# EAGLE design 2 Motors_V4 (EAGLE 9.6.2)
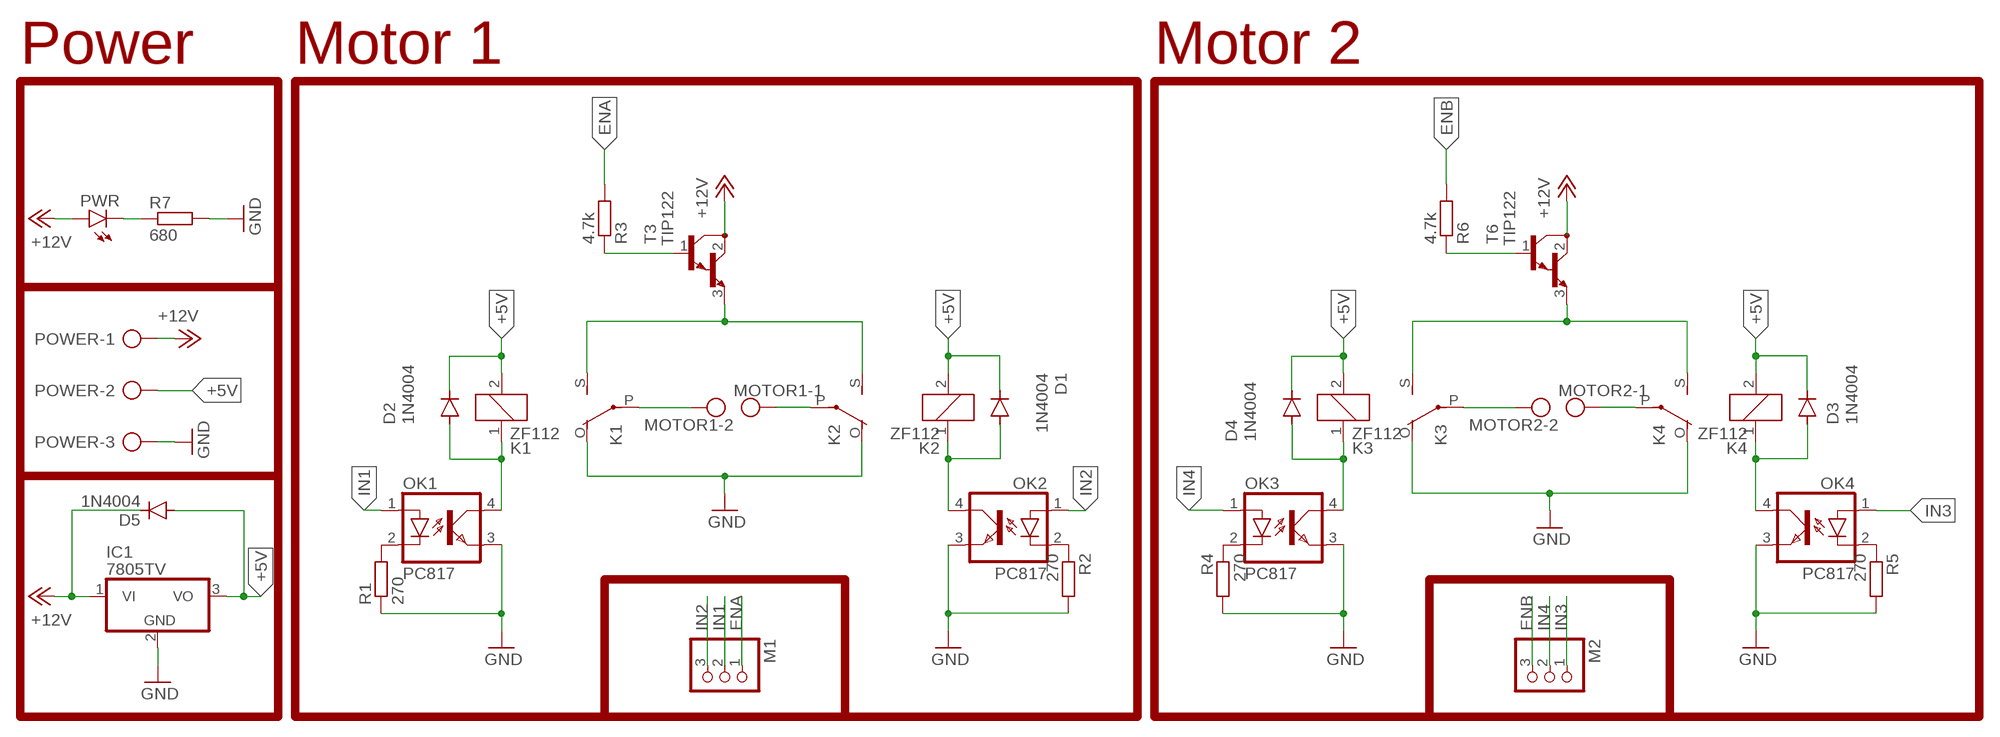
[diagram p0: schematic, sheet 1]

## Parts
D1  1N4004  [DO41-10]
D2  1N4004  [DO41-10]
D3  1N4004  [DO41-10]
D4  1N4004  [DO41-10]
D5  1N4004  [DO41-10]
IC1  7805TV  [TO220V]
K1  ZF112  [ZF112]
K2  ZF112  [ZF112]
K3  ZF112  [ZF112]
K4  ZF112  [ZF112]
M1  PINHD-1X3  [1X03]
M2  PINHD-1X3  [1X03]
MOTOR1  AK300/2  [AK300/2]
MOTOR2  AK300/2  [AK300/2]
OK1  PC817  [DIL04]
OK2  PC817  [DIL04]
OK3  PC817  [DIL04]
OK4  PC817  [DIL04]
POWER  AK300/3  [AK300/3]
PWR  LED5MM  [LED5MM]
R1  270  R-EU_0204/7  [0204/7]
R2  270  R-EU_0204/7  [0204/7]
R3  4.7k  R-EU_0204/7  [0204/7]
R4  270  R-EU_0204/7  [0204/7]
R5  270  R-EU_0204/7  [0204/7]
R6  4.7k  R-EU_0204/7  [0204/7]
R7  680  R-EU_0204/7  [0204/7]
T3  TIP122  [TO220]
T6  TIP122  [TO220]

## Nets
+5V: D1.C D2.C D3.C D4.C D5.A IC1.3(VO) K1.2 K2.2 K3.2 K4.2 POWER.2
+12V: D5.C IC1.1(VI) POWER.1 PWR.A T3.2(C) T6.2(C)
ENA: M1.1 R3.2
ENB: M2.3 R6.2
GND: IC1.2(GND) K1.O(2:O) K2.O(2:O) K3.O(2:O) K4.O(2:O) OK1.3(EMIT) OK2.3(EMIT) OK3.3(EMIT) OK4.3(EMIT) POWER.3 R1.1 R2.2 R4.2 R5.2 R7.2
IN1: M1.2 OK1.1(A)
IN2: M1.3 OK2.1(A)
IN3: M2.1 OK4.1(A)
IN4: M2.2 OK3.1(A)
N$1: K1.P(2:P) MOTOR1.2
N$2: K1.S(2:S) K2.S(2:S) T3.3(E)
N$3: D2.A K1.1 OK1.4(COL)
N$4: PWR.K(C) R7.1
N$5: K2.P(2:P) MOTOR1.1
N$6: D1.A K2.1 OK2.4(COL)
N$7: D3.A K4.1 OK4.4(COL)
N$8: K3.S(2:S) K4.S(2:S) T6.3(E)
N$9: D4.A K3.1 OK3.4(COL)
N$10: OK1.2(C) R1.2
N$11: OK2.2(C) R2.1
N$12: OK4.2(C) R5.1
N$13: OK3.2(C) R4.1
N$14: K4.P(2:P) MOTOR2.1
N$16: K3.P(2:P) MOTOR2.2
T3: R3.1 T3.1(B)
T6: R6.1 T6.1(B)

## Notes on the sheet
- Power | Motor 1 | Motor 2

## Library data of the parts
D1-D5 = diode:1N4004: DIODE general purpose rectifier, 1 A
IC1 = linear:78*: Positive VOLTAGE REGULATOR Source: http://cache.national.com/ds/LM/LM78L05.pdf http://www.fairchildsemi.com/ds/LM/LM7805.pdf
K1-K4 = relay:ZF112: RELAY 1 x switch; OC_FARNELL: unknown; OC_NEWARK: unknown
M1 M2 = pinhead:PINHD-1X3: PIN HEADER
MOTOR1 MOTOR2 = con-ptr500:AK300/2: CONNECTOR; OC_FARNELL: unknown; OC_NEWARK: unknown
OK1-OK4 = optocoupler:PC817: SHARP OPTO COUPLER; MPN: PC817X4J000F; OC_FARNELL: 9707727; OC_NEWARK: 97K7059
POWER = con-ptr500:AK300/3: CONNECTOR; OC_FARNELL: unknown; OC_NEWARK: unknown
PWR = led:LED: LED OSRAM: - CHIPLED LG R971, LG N971, LY N971, LG Q971, LY Q971, LO R971, LY R971 LH N974, LH R974 LS Q976, LO Q976, LY Q976 LO Q996 - Hyper CHIPLED LW Q18S LB Q993, LB Q99A, LB R99A - SideLED LS A670, LO A670, LY A670, LG A670, LP A670 LB A673, LV A673, LT A673, LW A673 LH A674 LY A675 LS A676, LA A676, LO A676, LY A676, LW A676 LS A679, LY A679, LG A679 - Hyper Micro SIDELED® LS Y876, LA Y876, LO Y876, LY Y876 LT Y87S - SmartLED LW L88C, LW L88S LB L89C, LB L89S, LG L890 LS L89K, LO L89K, LY L89K LS L896, LA L896, LO L896, LY L896 - TOPLED LS T670, LO T670, LY T670, LG T670, LP T670 LSG T670, LSP T670, LSY T670, LOP T670, LYG T670 LG T671, LOG T671, LSG T671 LB T673, LV T673, LT T673, LW T673 LH T674 LS T676, LA T676, LO T676, LY T676, LB T676, LH T676, LSB T676, LW T676 LB T67C, LV T67C, LT T67C, LS T67K, LO T67K, LY T67K, LW E67C LS E67B, LA E67B, LO E67B, LY E67B, LB E67C, LV E67C, LT E67C LW T67C LS T679, LY T679, LG T679 LS T770, LO T770, LY T770, LG T770, LP T770 LB T773, LV T773, LT T773, LW T773 LH T774 LS E675, LA E675, LY E675, LS T675 LS T776, LA T776, LO T776, LY T776, LB T776 LHGB T686 LT T68C, LB T68C - Hyper Mini TOPLED® LB M676 - Mini TOPLED Santana® LG M470 LS M47K, LO M47K, LY M47K Source: http://www.osram.convergy.de LUXEON: - LUMILED® LXK2-PW12-R00, LXK2-PW12-S00, LXK2-PW14-U00, LXK2-PW14-V00 LXK2-PM12-R00, LXK2-PM12-S00, LXK2-PM14-U00 LXK2-PE12-Q00, LXK2-PE12-R00, LXK2-PE12-S00, LXK2-PE14-T00, LXK2-PE14-U00 LXK2-PB12-K00, LXK2-PB12-L00, LXK2-PB12-M00, LXK2-PB14-N00, LXK2-PB14-P00, LXK2-PB14-Q00 LXK2-PR12-L00, LXK2-PR12-M00, LXK2-PR14-Q00, LXK2-PR14-R00 LXK2-PD12-Q00, LXK2-PD12-R00, LXK2-PD12-S00 LXK2-PH12-R00, LXK2-PH12-S00 LXK2-PL12-P00, LXK2-PL12-Q00, LXK2-PL12-R00 Source: www.luxeon.com KINGBRIGHT: KA-3528ASYC Source: www.kingbright.com
R1-R7 = rcl:R-EU_: RESISTOR, European symbol; SPICEPREFIX: R
T3 T6 = transistor:TIP122: NPN BIPOLAR DARLINGTON TRANSISTOR

## Board
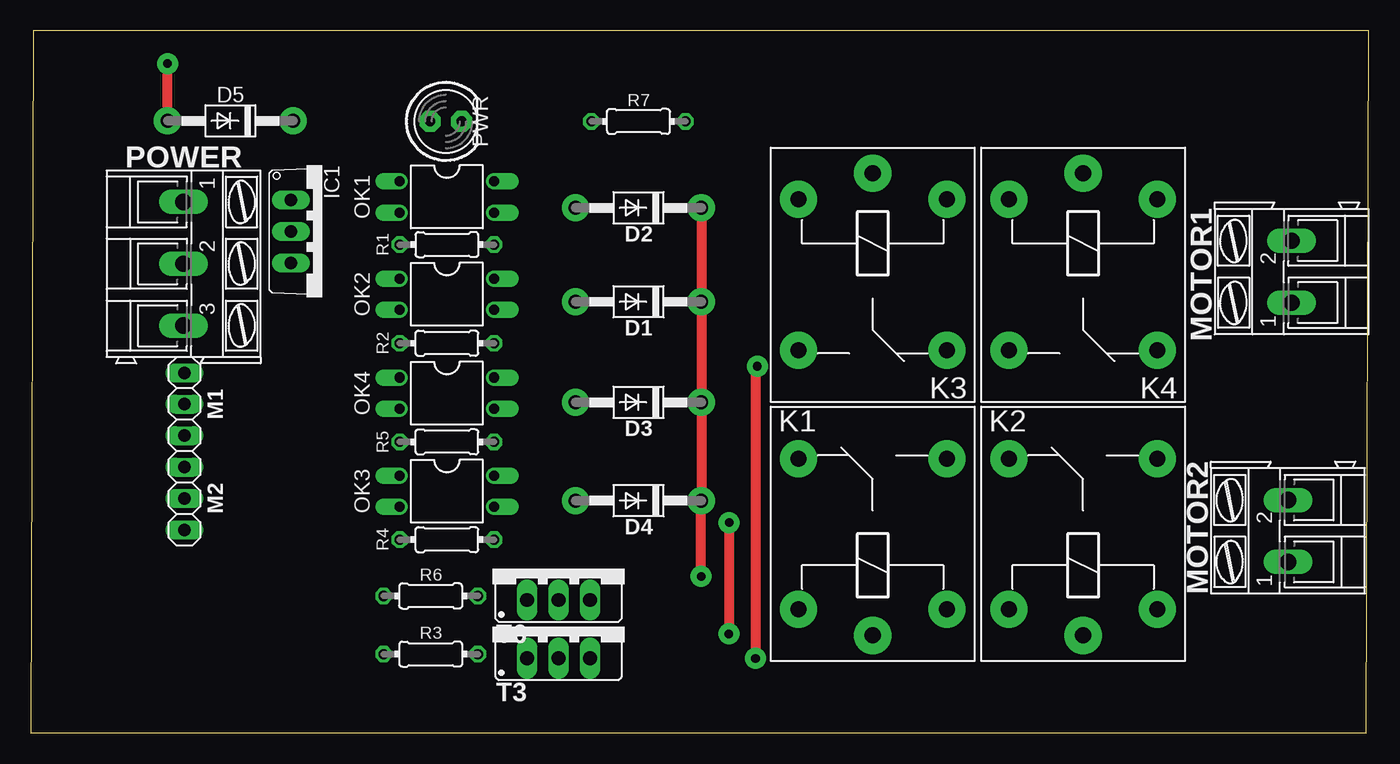
[diagram p1: board, top side]
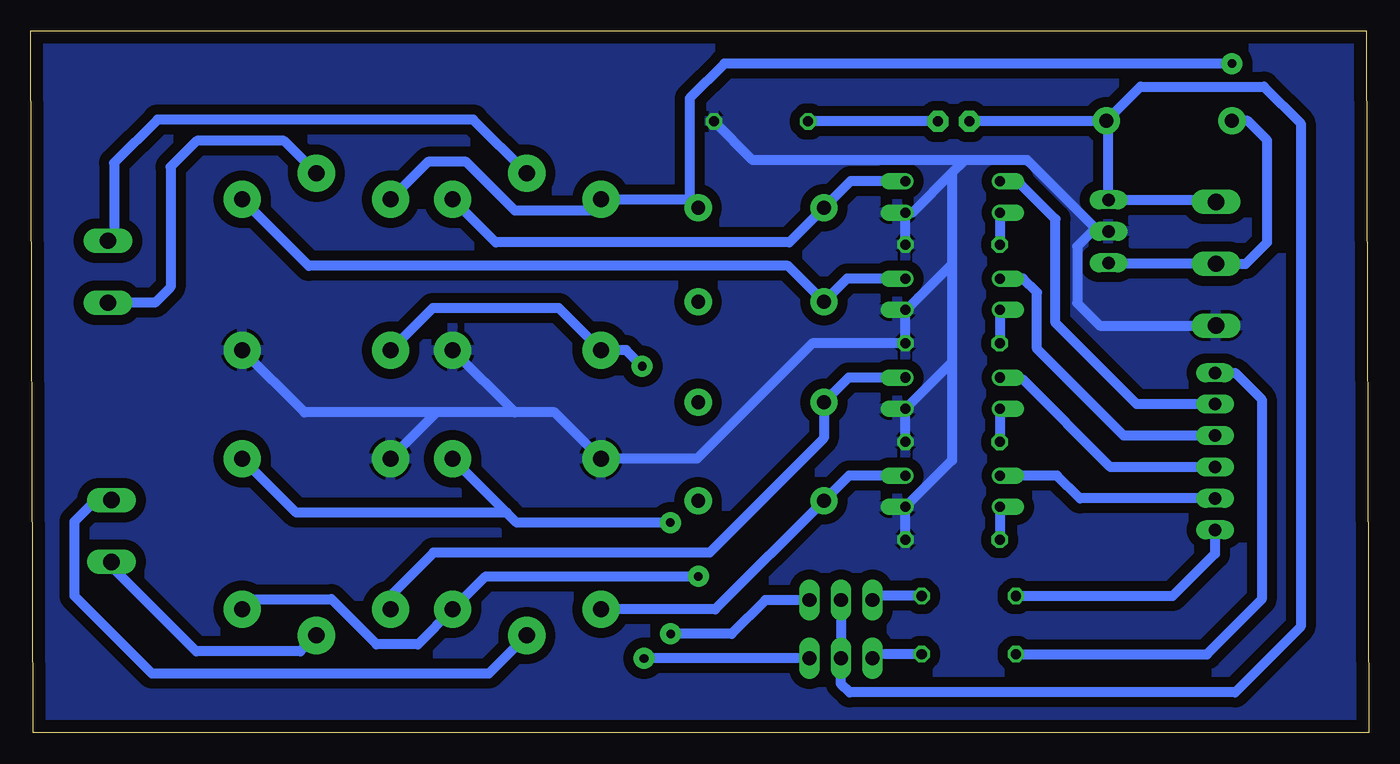
[diagram p2: board, bottom side, seen from below]

Size 108.18 x 56.74 mm. Coordinates in mm from the lower left corner, seen from the top.
Outline: 108,0 108.18,56.74 0.18,56.74 0,0 108,0
Copper layers (1*16): Top 0.035mm / dielectric 1.5mm / Bottom 0.035mm
Design rules "default *": minimum track width 0.8mm, minimum drill 0.35mm, track to track 0.6mm, track to pad 0.6mm, pad to pad 0.6mm, via to via 0.6mm, smd to smd 0.6mm, copper to edge 40mil, drill to drill 6mil, minimum pad ring 10mil, minimum via ring 8mil, stop-mask expansion 4mil, vias tented up to drill 0mil, thermal gap 10mil

### Footprints (pad centres in the part's own frame; a part is rotated, then mirrored left to right if it is on the bottom)
DO41-10 = drill 1.118 pad 2.2: A 5.08,0; C -5.08,0
TO220V = drill 1.016 long: 1 -2.54,-2.54; 2 0,-2.54; 3 2.54,-2.54
ZF112 = drill 1.3 pad 3: 1 -6.096,5.994; 2 -6.096,-5.994; O 6.096,5.994; P -8.204,0; S 6.096,-5.994
1X03 = drill 1.016 long: 1 -2.54,0; 2 0,0; 3 2.54,0
AK300/2 = drill 1.321 long: 1 -2.515,0; 2 2.489,0
DIL04 = drill 0.813 offset: 1 -1.27,-3.81; 2 1.27,-3.81; 3 1.27,3.81; 4 -1.27,3.81
AK300/3 = drill 1.321 long: 1 -5.004,0; 2 0,0; 3 5.004,0
LED5MM = drill 0.813 pad 1.7 octagon: A -1.27,0; K 1.27,0
0204/7 = drill 0.813 octagon: 1 -3.81,0; 2 3.81,0
TO220 = drill 1.118 long: 1 -2.54,0; 2 0,0; 3 2.54,0

### Placement (x,y rotation side)
D1  49.13,34.85 180 top
D2  49.13,42.44 180 top
D3  49.13,26.72 180 top
D4  49.13,18.77 180 top
D5  16.13,49.48 180 top
IC1  23.57,40.54 270 top
K1  68.07,37.03 270 top
K2  85.09,37.03 270 top
K3  68.07,16.08 90 top
K4  85.09,16.08 90 top
M1  12.42,26.57 270 top
M2  12.42,18.95 270 top
MOTOR1  101.96,37.29 90 top
MOTOR2  101.65,16.33 90 top
OK1  33.64,43.33 270 top
OK2  33.64,35.46 270 top
OK3  33.64,19.53 270 top
OK4  33.64,27.46 270 top
POWER  12.34,37.92 270 top
PWR  33.55,49.43 0 top
R1  33.64,39.47 180 top
R2  33.64,31.5 0 top
R3  32.33,6.37 180 top
R4  33.64,15.62 0 top
R5  33.64,23.52 0 top
R6  32.33,11.06 180 top
R7  49.13,49.43 0 top
T3  42.67,6.04 0 top
T6  42.67,10.73 0 top

### Tracks (layer width: path | path; a pad name or v marks a point on that pad's centre or on a via)
+5V  (via drill 0.7 pad 1.7)
  Top 0.813: D2.C D1.C D3.C D4.C v54.2,12.65 | D5.A v11.05,54.1
  Bottom 0.813: IC1.3 20.95,37.92 POWER.2 9.93,37.92 8.2,39.65 8.2,47.9 9.78,49.48 D5.A | v54.2,12.65 71.4,12.65 K3.2 76.89,7.16 80.22,7.16 83.87,10.81 90.25,10.81 K4.2 | K2.2 76.07,46.15 72.97,46.15 69.04,42.22 62.99,42.22 K1.2 54.9,43.13 | 54.9,43.13 D2.C | v11.05,54.1 52.09,54.1 54.9,51.3 54.9,43.13
+12V
  Bottom 0.813: POWER.1 12.5,43.08 IC1.1 21.03,49.3 D5.C | D5.C 21.26,49.43 PWR.A | T6.2 T3.2 42.67,3.99 41.96,3.28 10.79,3.28 5.49,8.59 5.49,49.28 8.46,52.25 18.44,52.25 D5.C
ENA
  Bottom 0.813: M1.1 10.79,29.11 8.64,26.95 8.64,10.79 13.08,6.35 28.51,6.35 R3.2
ENB
  Bottom 0.813: R6.2 15.83,11.06 12.42,14.48 M2.3
GND
  Bottom 0.813: R4.2 OK3.3 33.68,22.04 33.68,29.96 | R5.2 OK4.3 33.68,29.96 | R1.1 OK1.3 36.91,42.06 33.68,45.29 | IC1.2 21.92,40.54 | IC1.2 21.85,40.54 27.61,46.3 32.66,46.3 | 33.68,45.29 32.66,46.3 | 33.68,45.29 33.68,37.9 | 33.68,37.9 37.39,34.19 OK2.3 R2.2 44.98,31.5 54.3,22.17 K3.O 65.81,25.91 69.04,25.91 | 33.68,37.9 33.68,29.96 | IC1.2 22.35,40.54 23.56,39.33 23.56,34.74 21.74,32.92 POWER.3 | 32.66,46.3 49.82,46.3 R7.2 | K2.O 86.06,25.91 75.39,25.91 | 69.04,25.91 75.39,25.91 | 69.04,25.91 K1.O | 75.39,25.91 79.1,22.2 K4.O
  pour Bottom (isolate 0.8): -2.54,58.42 110.49,58.42 110.49,-1.27 -2.54,-1.27
IN1
  Bottom 0.813: M1.2 18.75,26.57 25.32,33.15 25.32,41.53 28.4,44.6 OK1.1
IN2
  Bottom 0.813: M1.3 19.81,24.03 26.82,31.04 26.82,35.61 27.94,36.73 OK2.1
IN3
  Bottom 0.813: M2.1 20.88,21.49 27.96,28.57 29.68,28.57 OK4.1
IN4
  Bottom 0.813: M2.2 23.34,18.95 25.2,20.8 OK3.1
N$1
  Bottom 0.813: K1.P 72.42,49.58 97.94,49.58 101.45,46.08 101.45,40.28 MOTOR1.2
N$2  (via drill 0.7 pad 1.7)
  Top 0.813: v58.75,29.64 58.6,29.49 v58.6,6.02
  Bottom 0.813: T3.3 58.58,6.04 v58.6,6.02 | v58.75,29.64 60.05,30.94 K1.S 65.48,34.34 75.69,34.34 K2.S
N$3
  Bottom 0.813: OK1.4 41.89,44.6 D2.A 46.85,39.65 70.59,39.65 K1.1
N$4
  Bottom 0.813: PWR.K R7.1
N$5
  Bottom 0.813: K2.P 87.71,47.85 94.77,47.85 96.88,45.74 96.88,36.04 98.15,34.77 MOTOR1.1
N$6
  Bottom 0.813: OK2.4 42.17,36.73 D1.A 46.95,37.74 85.7,37.74 K2.1
N$7
  Bottom 0.813: OK4.4 42.05,28.73 D3.A 44.05,23.82 53.3,14.58 75.62,14.58 79.1,11.1 K4.1
N$8  (via drill 0.7 pad 1.7)
  Top 0.813: v56.44,8 56.44,16.97 v56.46,16.99
  Bottom 0.813: T6.3 48.78,10.73 51.51,8 v56.44,8 | v56.46,16.99 68.89,16.99 69.7,17.8 | 69.7,17.8 K3.S | 69.7,17.8 86.72,17.8 K4.S
N$9
  Bottom 0.813: OK3.4 42.02,20.8 D4.A 52.84,9.98 K3.1
N$10
  Bottom 0.813: OK1.2 R1.2
N$11
  Bottom 0.813: OK2.2 R2.1
N$12
  Bottom 0.813: OK4.2 R5.1
N$13
  Bottom 0.813: OK3.2 R4.1
N$14
  Bottom 0.813: K4.P 86.39,6.58 94.79,6.58 101.65,13.44 MOTOR2.1
N$16
  Bottom 0.813: MOTOR2.2 102.92,18.82 104.67,17.07 104.67,11.07 98.4,4.8 71.14,4.8 K3.P
T3
  Bottom 0.813: R3.1 39.8,6.37 T3.1
T6
  Bottom 0.813: R6.1 39.8,11.06 T6.1